# EAGLE design notes1a (EAGLE 6.5.0)
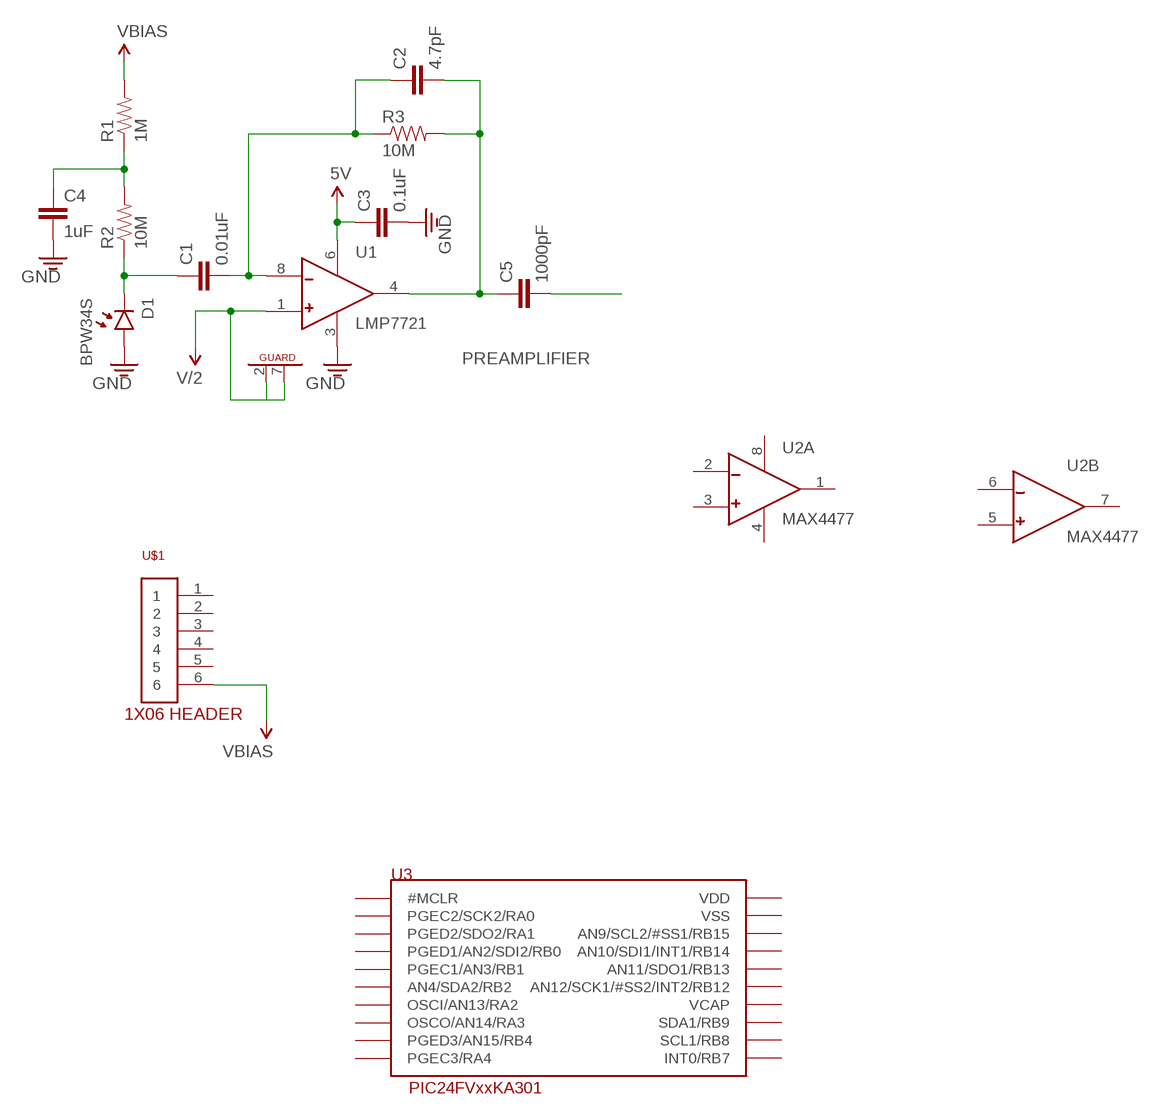
[diagram p0: schematic, sheet 1]

## Parts
C1  0.01uF  CAP0603  [0603]
C2  4.7pF  CAP0603  [0603]
C3  0.1uF  CAP0603  [0603]
C4  1uF  CAP0603  [0603]
C5  1000pF  CAP0603  [0603]
D1  BPW34S  PHOTODIODE  [BPW34S-SIDEMOUNT]
R1  1M  RESISTOR0603  [0603]
R2  10M  RESISTOR0603  [0603]
R3  10M  RESISTOR0603  [0603]
U1  LMP7721  OPAMP-LMP7721  [SOIC-8]
U2  MAX4477  OPAMP-MAX4477  [SOIC-8]
U3  PIC24FVXXKA301  [SOIC-20]
U$1  1X06  [1X06]

## Nets
5V: C3.1 U1.6(VCC)
GND: C3.2 C4.2 D1.A(ANODE) U1.3(GND)
N$1: C1.2 C2.1 R3.1 U1.8(-)
N$2: C1.1 D1.C(CATHODE) R2.1
N$4: C4.1 R1.1 R2.2
N$7: C2.2 C5.1 R3.2 U1.4(OUT)
N$10: C5.2
V/2: U1.1(+) U1.2(G1) U1.7(G2)
VBIAS: R1.2 U$1.6
Unconnected: U2.1(A:OUT) U2.2(A:-) U2.3(A:+) U2.4(A:V-) U2.5(B:+) U2.6(B:-) U2.7(B:OUT) U2.8(A:V+) U3.1(#MCLR) U3.2(PGEC2/SCK2/RA0) U3.3(PGED2/SDO2/RA1) U3.4(PGED1/AN2/SDI2/RB0) U3.5(PGEC1/AN3/RB1) U3.6(AN4/SDA2/RB2) U3.7(OSCI/AN13/RA2) U3.8(OSCO/AN14/RA3) U3.9(PGED3/AN15/RB4) U3.10(PGEC3/RA4) U3.11(INT0/RB7) U3.12(SCL1/RB8) U3.13(SDA1/RB9) U3.14(VCAP) U3.15(AN12/SCK1/#SS2/INT2/RB12) U3.16(AN11/SDO1/RB13) U3.17(AN10/SDI1/INT1/RB14) U3.18(AN9/SCL2/#SS1/RB15) U3.19(VSS) U3.20(VDD) U$1.1 U$1.2 U$1.3 U$1.4 U$1.5

## Notes on the sheet
- PREAMPLIFIER

## Library data of the parts
C1-C5 = openct:CAP: Capacitor Standard 0603 ceramic capacitor, and 0.1" leaded capacitor.
D1 = openct:PHOTODIODE: Photodiodes sensitive to high-energy particles
R1-R3 = openct:RESISTOR: Resistor Basic schematic elements and footprints for 0603, 1206, and PTH 1/10th watt (small) resistors.
U1 = openct:OPAMP-LMP7721: TI LMP7721 Precision Amplifier (3-Femtoamp Input Bias)
U2 = openct:OPAMP-MAX4477: Maxim MAX4477 Low-noise, low-distortion dual op amp
U3 = openct:PIC24FVXXKA301: Microchip PIC24FVxxKA301 microcontroller (2k ram, 12-bit adc, 2-5.5V operating voltage)
U$1 = openct:1X06

## Board
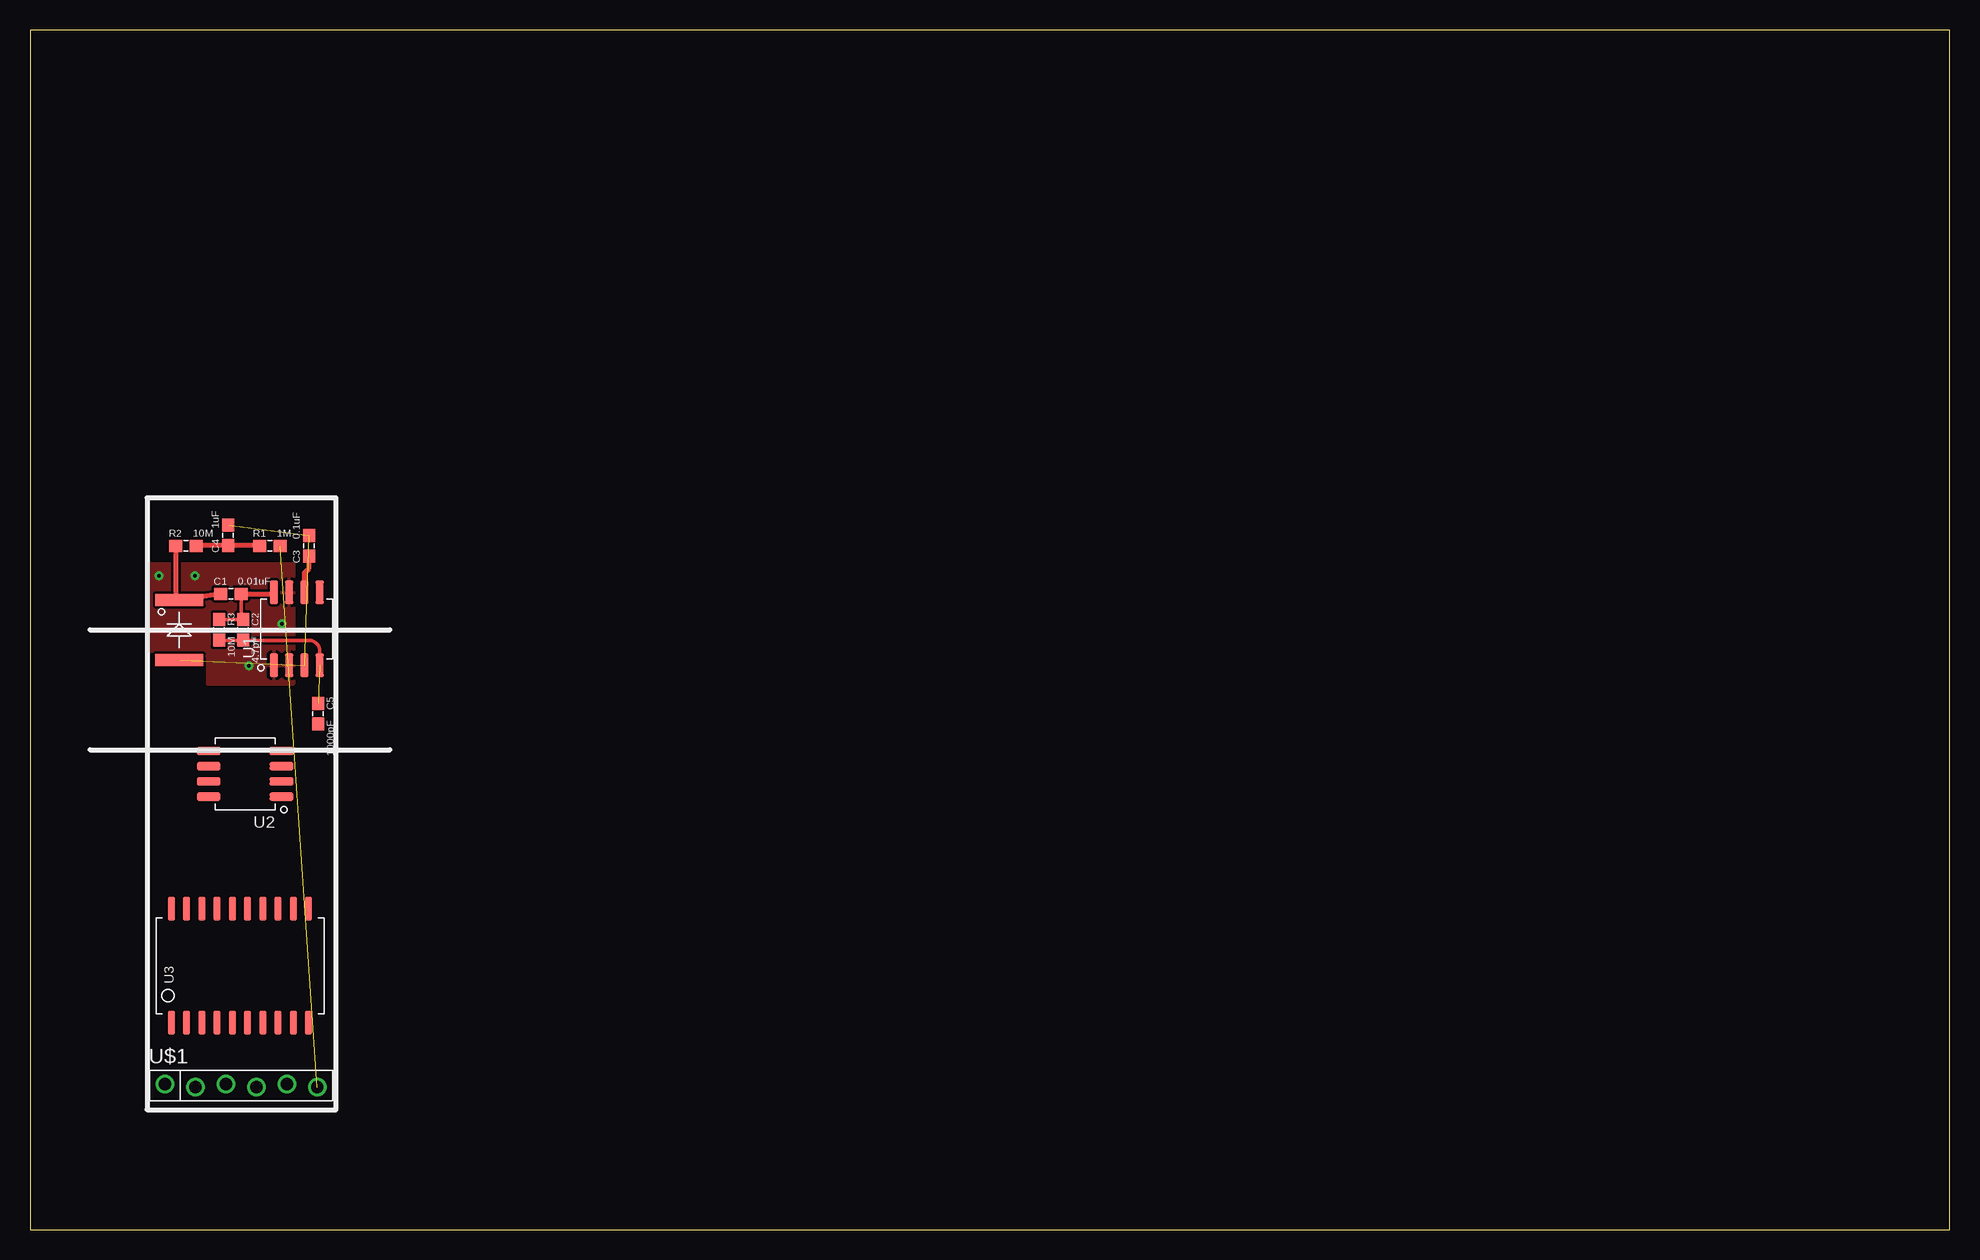
[diagram p1: board, top side]
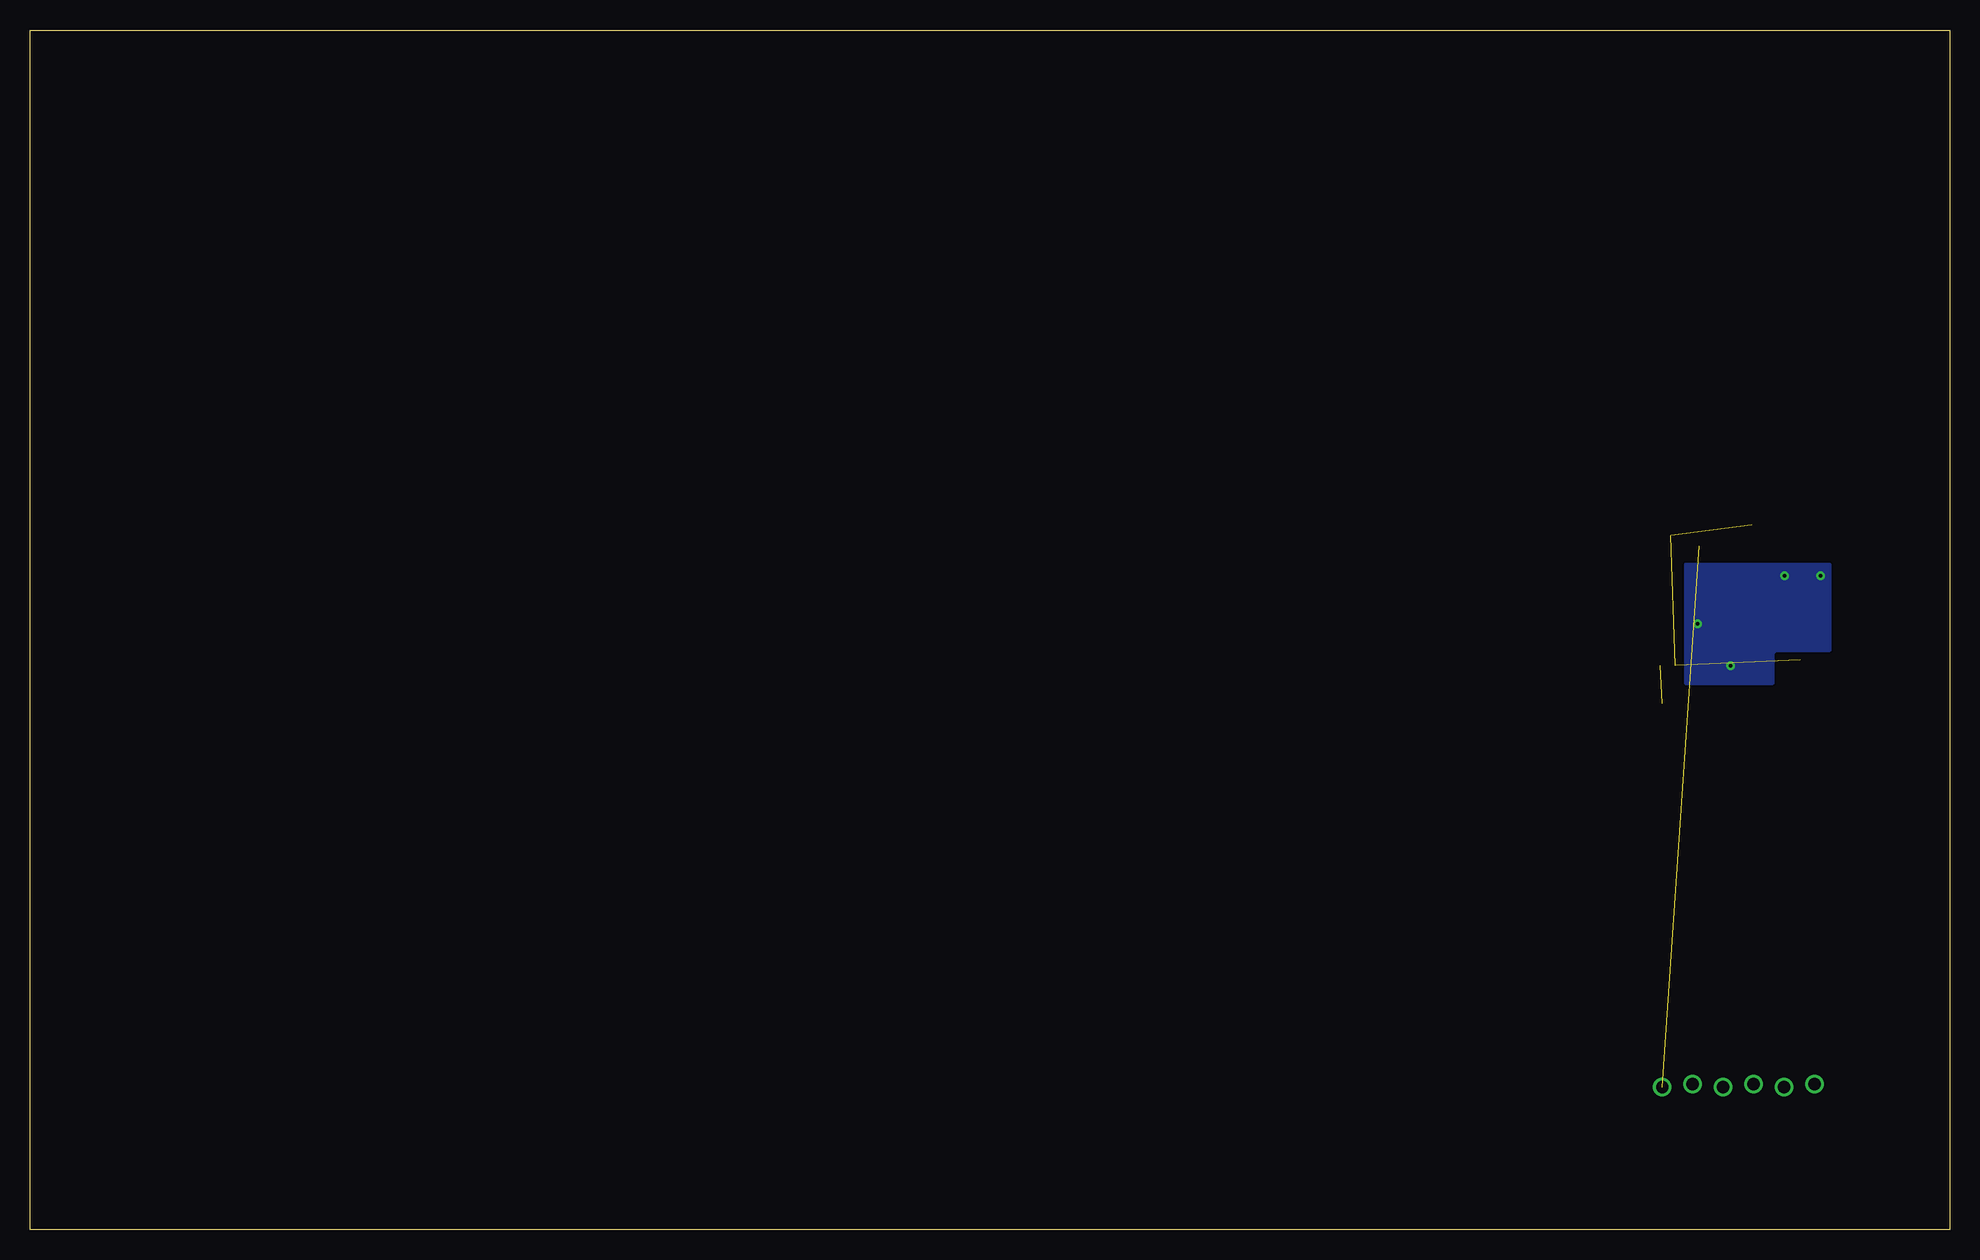
[diagram p2: board, bottom side, seen from below]

Size 160 x 100 mm. Coordinates in mm from the lower left corner, seen from the top.
Outline: 0,0 160,0 160,100 0,100 0,0
Copper layers (1*16): Top 0.035mm / dielectric 1.5mm / Bottom 0.035mm
Design rules "default": minimum track width 10mil, minimum drill 24mil, track to track 8mil, track to pad 8mil, pad to pad 8mil, via to via 8mil, smd to smd 8mil, copper to edge 40mil, drill to drill 8mil, minimum pad ring 10mil, minimum via ring 8mil, stop-mask expansion 4mil, vias tented up to drill 0mil, thermal gap 10mil

### Footprints (pad centres in the part's own frame; a part is rotated, then mirrored left to right if it is on the bottom)
0603 = smd 1.1 x 1: 1 -0.85,0; 2 0.85,0
BPW34S-SIDEMOUNT = smd 1 x 4: A -2.5,-0.5; C 2.5,-0.5
SOIC-8 = smd 0.7 x 2: 1 -1.905,-3.04; 2 -0.635,-3.04; 3 0.635,-3.04; 4 1.905,-3.04; 5 1.905,3.04; 6 0.635,3.04; 7 -0.635,3.04; 8 -1.905,3.04
SOIC-20 = smd 0.6 x 2: 1 -5.715,-4.762; 2 -4.445,-4.762; 3 -3.175,-4.762; 4 -1.905,-4.762; 5 -0.635,-4.762; 6 0.635,-4.762; 7 1.905,-4.762; 8 3.175,-4.762; 9 4.445,-4.762; 10 5.715,-4.762; 11 5.715,4.763; 12 4.445,4.763; 13 3.175,4.763; 14 1.905,4.763; 15 0.635,4.763; 16 -0.635,4.763; 17 -1.905,4.763; 18 -3.175,4.763; 19 -4.445,4.763; 20 -5.715,4.763
1X06 = drill 1.016: 1 0,0.127; 2 2.54,-0.127; 3 5.08,0.127; 4 7.62,-0.127; 5 10.16,0.127; 6 12.7,-0.127

### Placement (x,y rotation side)
C1  16.75,53 0 top
C2  17.75,50 270 top
C3  23.25,57 90 top
C4  16.5,57.88 90 top
C5  24,43 270 top
D1  11.94,49.99 90 top
R1  20,57 0 top
R2  13,57 0 top
R3  15.75,50 270 top
U1  22.24,50.08 0 top
U2  17.93,37.99 90 top
U3  17.5,22 0 top
U$1  11.25,12 0 top

### Tracks (layer width: path | path; a pad name or v marks a point on that pad's centre or on a via)
5V
  Top 0.406: U1.6 22.88,54.75 23.25,55.12 C3.1
GND  (3 unrouted)
N$1
  Top 0.305: R3.1 C2.1 arc-90 17.6,51 C1.2
  Top 0.406: C1.2 20.21,53 arc90 U1.8
N$2
  Top 0.406: C1.1 D1.C 12.15,52.49 R2.1
N$4
  Top 0.406: R1.1 19.15,57.02 C4.1 13.88,57.02 arc90 R2.2
N$7  (1 unrouted)
  Top 0.305: U1.4 24.14,48.23 arc90 23.25,49.12 17.75,49.12 | 17.75,49.12 15.78,49.12 arc-90 R3.2 | C2.2 17.75,49.12
V/2  (via drill 0.33)
  other vias: 21,50.5 18.25,47 13.75,54.5 10.75,54.5
  pour Top: 22,45.5 22,55.5 10,55.5 10,48.25 14.25,48.25 14.75,47.75 14.75,45.5
  pour Bottom: 22,45.5 22,55.5 10,55.5 10,48.25 14.5,48.25 14.75,48 14.75,45.5
VBIAS  (1 unrouted)